# Altium schematic sheet Passive_Circuits.SchDoc
size A4; SheetNumber: 3; SheetTotal: 11
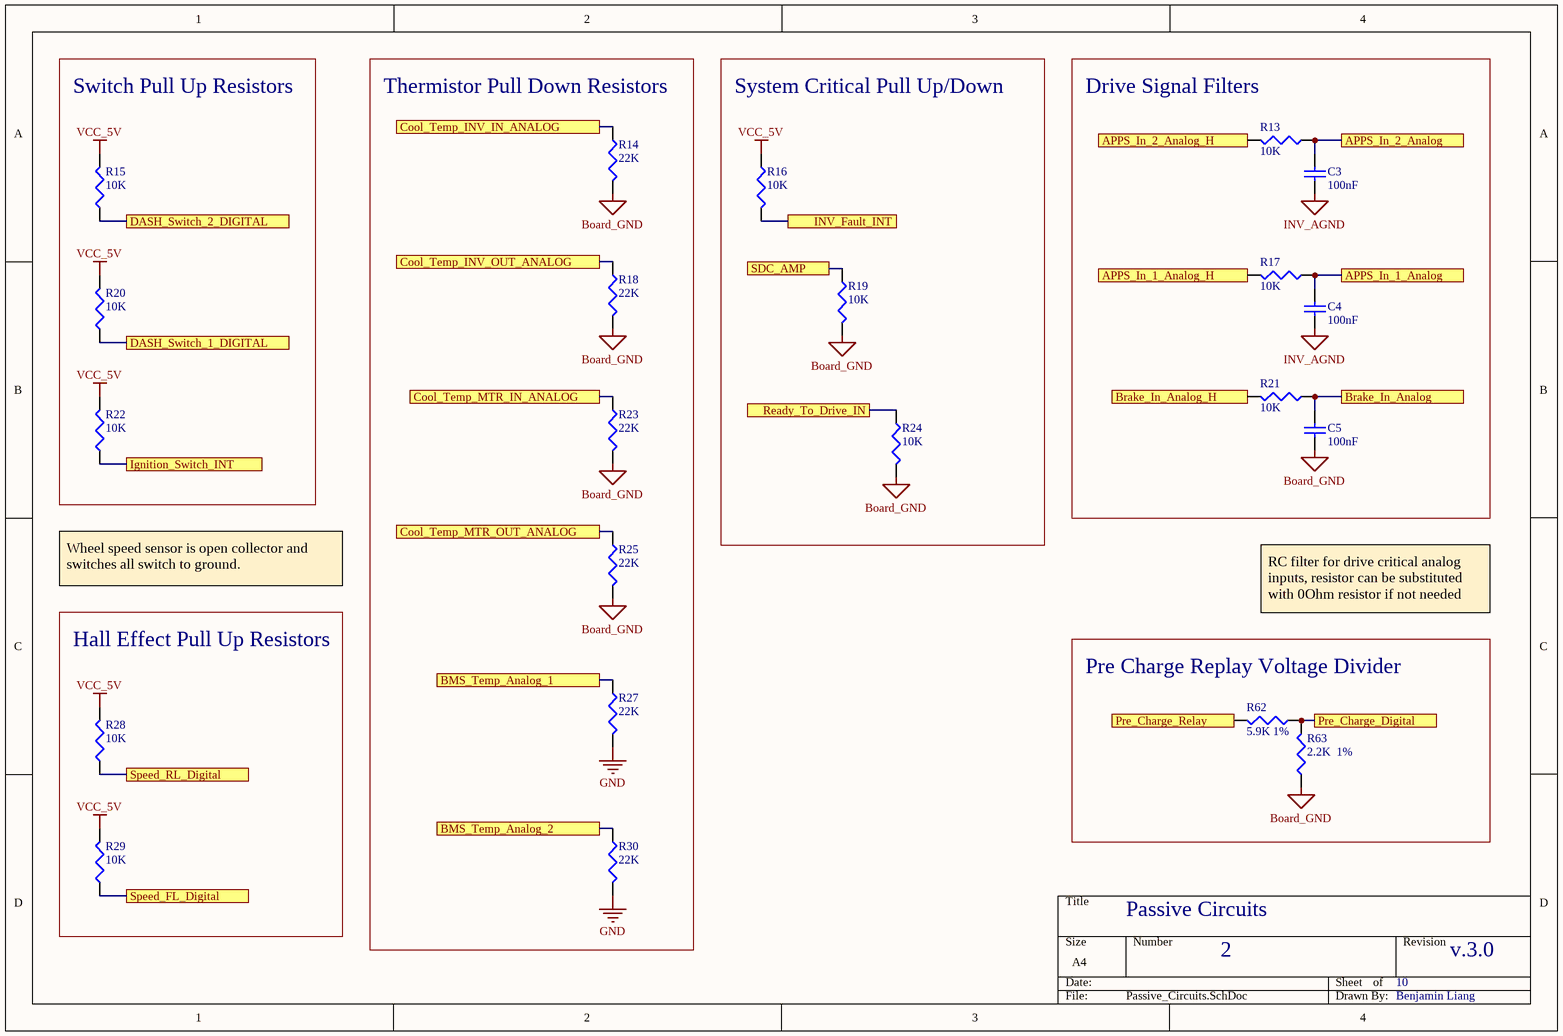
[diagram p0: Passive_Circuits.SchDoc]

## Parts
C3  100nF  [C1206]
C4  100nF  [C1206]
C5  100nF  [C1206]
R13  10K  [J1-0603]
R14  22K  [J1-0603]
R15  10K  [J1-0603]
R16  10K  [J1-0603]
R17  10K  [J1-0603]
R18  22K  [J1-0603]
R19  10K  [J1-0603]
R20  10K  [J1-0603]
R21  10K  [J1-0603]
R22  10K  [J1-0603]
R23  22K  [J1-0603]
R24  10K  [J1-0603]
R25  22K  [J1-0603]
R27  22K  [J1-0603]
R28  10K  [J1-0603]
R29  10K  [J1-0603]
R30  22K  [J1-0603]
R62  5.9K 1%  [J1-0603]
R63  2.2K  1%  [J1-0603]

## Blocks framed on the sheet
Switch Pull Up Resistors: R15 R20 R22
Thermistor Pull Down Resistors: R14 R18 R23 R25 R27 R30
System Critical Pull Up/Down: R16 R19 R24
Drive Signal Filters: C3-C5 R13 R17 R21
Hall Effect Pull Up Resistors: R28 R29
Pre Charge Replay Voltage Divider: R62 R63

## Ports
APPS_In_1_Analog, APPS_In_1_Analog_H, APPS_In_2_Analog, APPS_In_2_Analog_H, BMS_Temp_Analog_1, BMS_Temp_Analog_2, Brake_In_Analog, Brake_In_Analog_H, Cool_Temp_INV_IN_ANALOG, Cool_Temp_INV_OUT_ANALOG, Cool_Temp_MTR_IN_ANALOG, Cool_Temp_MTR_OUT_ANALOG, DASH_Switch_1_DIGITAL, DASH_Switch_2_DIGITAL, Ignition_Switch_INT, INV_Fault_INT, Pre_Charge_Digital, Pre_Charge_Relay, Ready_To_Drive_IN, SDC_AMP, Speed_FL_Digital, Speed_RL_Digital

## Nets
Board_GND: C5.2 R14.2 R18.2 R19.2 R23.2 R24.1 R25.2 R63.1
GND: R27.2 R30.2
INV_AGND: C3.2 C4.2
VCC_5V: R15.2 R16.1 R20.2 R22.2 R28.2 R29.2
APPS_In_1_Analog: C4.1 R17.1 ; port APPS_In_1_Analog
APPS_In_1_Analog_H: R17.2 ; port APPS_In_1_Analog_H
APPS_In_2_Analog: C3.1 R13.1 ; port APPS_In_2_Analog
APPS_In_2_Analog_H: R13.2 ; port APPS_In_2_Analog_H
BMS_Temp_Analog_1: R27.1 ; port BMS_Temp_Analog_1
BMS_Temp_Analog_2: R30.1 ; port BMS_Temp_Analog_2
Brake_In_Analog: C5.1 R21.1 ; port Brake_In_Analog
Brake_In_Analog_H: R21.2 ; port Brake_In_Analog_H
Cool_Temp_INV_IN_ANALOG: R14.1 ; port Cool_Temp_INV_IN_ANALOG
Cool_Temp_INV_OUT_ANALOG: R18.1 ; port Cool_Temp_INV_OUT_ANALOG
Cool_Temp_MTR_IN_ANALOG: R23.1 ; port Cool_Temp_MTR_IN_ANALOG
Cool_Temp_MTR_OUT_ANALOG: R25.1 ; port Cool_Temp_MTR_OUT_ANALOG
DASH_Switch_1_DIGITAL: R20.1 ; port DASH_Switch_1_DIGITAL
DASH_Switch_2_DIGITAL: R15.1 ; port DASH_Switch_2_DIGITAL
Ignition_Switch_INT: R22.1 ; port Ignition_Switch_INT
INV_Fault_INT: R16.2 ; port INV_Fault_INT
Pre_Charge_Digital: R62.1 R63.2 ; port Pre_Charge_Digital
Pre_Charge_Relay: R62.2 ; port Pre_Charge_Relay
Ready_To_Drive_IN: R24.2 ; port Ready_To_Drive_IN
SDC_AMP: R19.1 ; port SDC_AMP
Speed_FL_Digital: R29.1 ; port Speed_FL_Digital
Speed_RL_Digital: R28.1 ; port Speed_RL_Digital

## Notes on the sheet
- Wheel speed sensor is open collector and switches all switch to ground.
- RC filter for drive critical analog inputs, resistor can be substituted with 0Ohm resistor if not needed
- Passive Circuits
- 2
- 10
- v.3.0
- Benjamin Liang

## Library data of the parts
C3-C5 = Cap Semi: Capacitor (Semiconductor SIM Model); Published: 8-Jun-2000; LatestRevisionDate: 29-May-2009; LatestRevisionNote: IPC-7351 Footprint Added.; PackageReference: C1206; Publisher: Altium Limited; PackageDescription: Chip Capacitor; Value: 100nF
R13 R17 R21 = Res3: Resistor; Published: 8-Jun-2000; LatestRevisionDate: 29-May-2009; LatestRevisionNote: IPC-7351 Footprint Added.; PackageReference: J1-0603; Publisher: Altium Limited; PackageDescription: Chip Resistor; Value: 10K
R14-R16 R18-R20 R22-R25 R27-R30 R62 R63 = Res3: Resistor; Value: 220; Published: 8-Jun-2000; LatestRevisionDate: 29-May-2009; LatestRevisionNote: IPC-7351 Footprint Added.; PackageReference: J1-0603; Publisher: Altium Limited; PackageDescription: Chip Resistor